# Altium schematic sheet Auxiliary.SchDoc: main_assy PCB
size A4
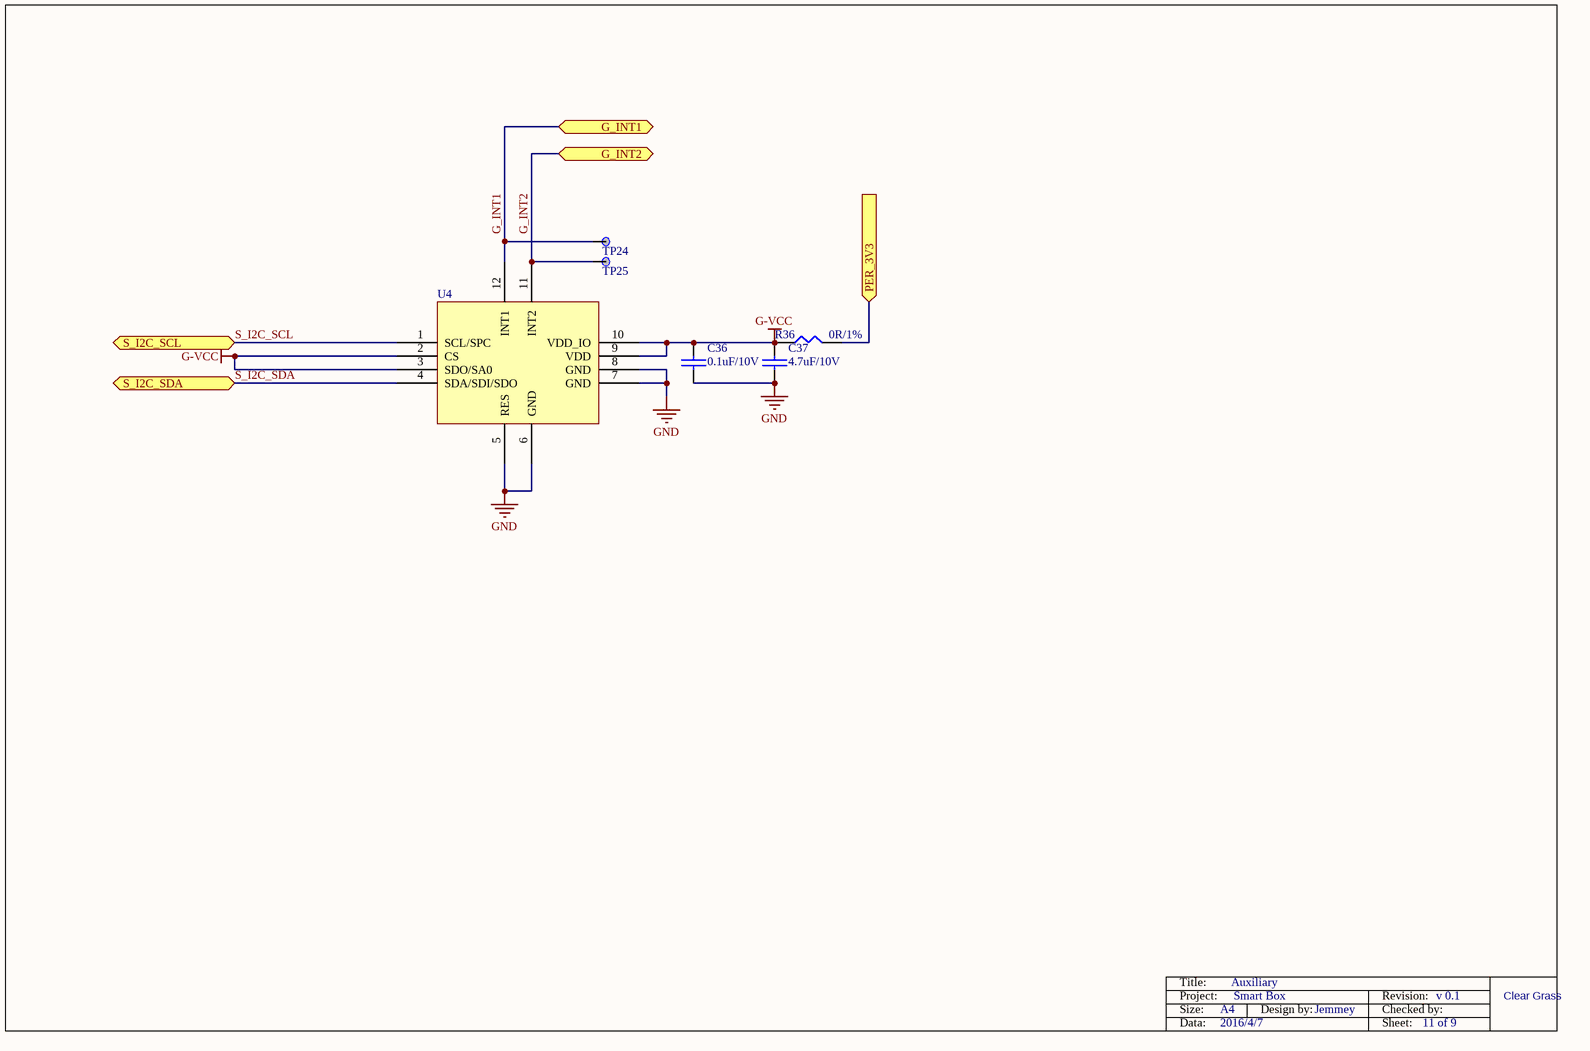
[diagram p0: Auxiliary.SchDoc]

## Parts
C36  0.1uF/10V  [0402C]
C37  4.7uF/10V  [0603C]
R36  0R/1%  [0402R]
TP24  TP  [TP_C40]  (value not drawn)
TP25  TP  [TP_C40]  (value not drawn)
U4  (no value)

## Ports
G_INT1 (bidir), G_INT2 (bidir), PER_3V3 (in), S_I2C_SCL (bidir), S_I2C_SDA (bidir)

## Nets
G-VCC: C36.1 C37.1 R36.1 U4.2(CS) U4.3(SDO/SA0) U4.9(VDD) U4.10(VDD_IO)
GND: C36.2 C37.2 U4.5(RES) U4.6(GND) U4.7(GND) U4.8(GND)
G_INT1: TP24.1 U4.12(INT1) ; port G_INT1
G_INT2: TP25.1 U4.11(INT2) ; port G_INT2
PER_3V3: R36.2 ; port PER_3V3
S_I2C_SCL: U4.1(SCL/SPC) ; port S_I2C_SCL
S_I2C_SDA: U4.4(SDA/SDI/SDO) ; port S_I2C_SDA

## Notes on the sheet
- Title:
- Auxiliary
- Project:
- Size:
- Data:
- A4
- 2016/4/7
- Smart Box
- Design by:
- Jemmey
- Revision:
- Sheet:
- Checked by:
- 11 of 9
- v 0.1
- Clear Grass

## Library data of the parts
C36 = CAP: 厂家：Murata，型号：GRM155R71A104KA01D
C37 = CAP: 厂家：Murata，型号：GRM188R61A106KE69D
R36 = RES1: 厂家：Yageo，型号：RC0402FR-0710KL
TP24 TP25 = TP: Ordered by: Subcon
U4 = LIS2DE12: 厂家：ST，型号：LIS2DH12